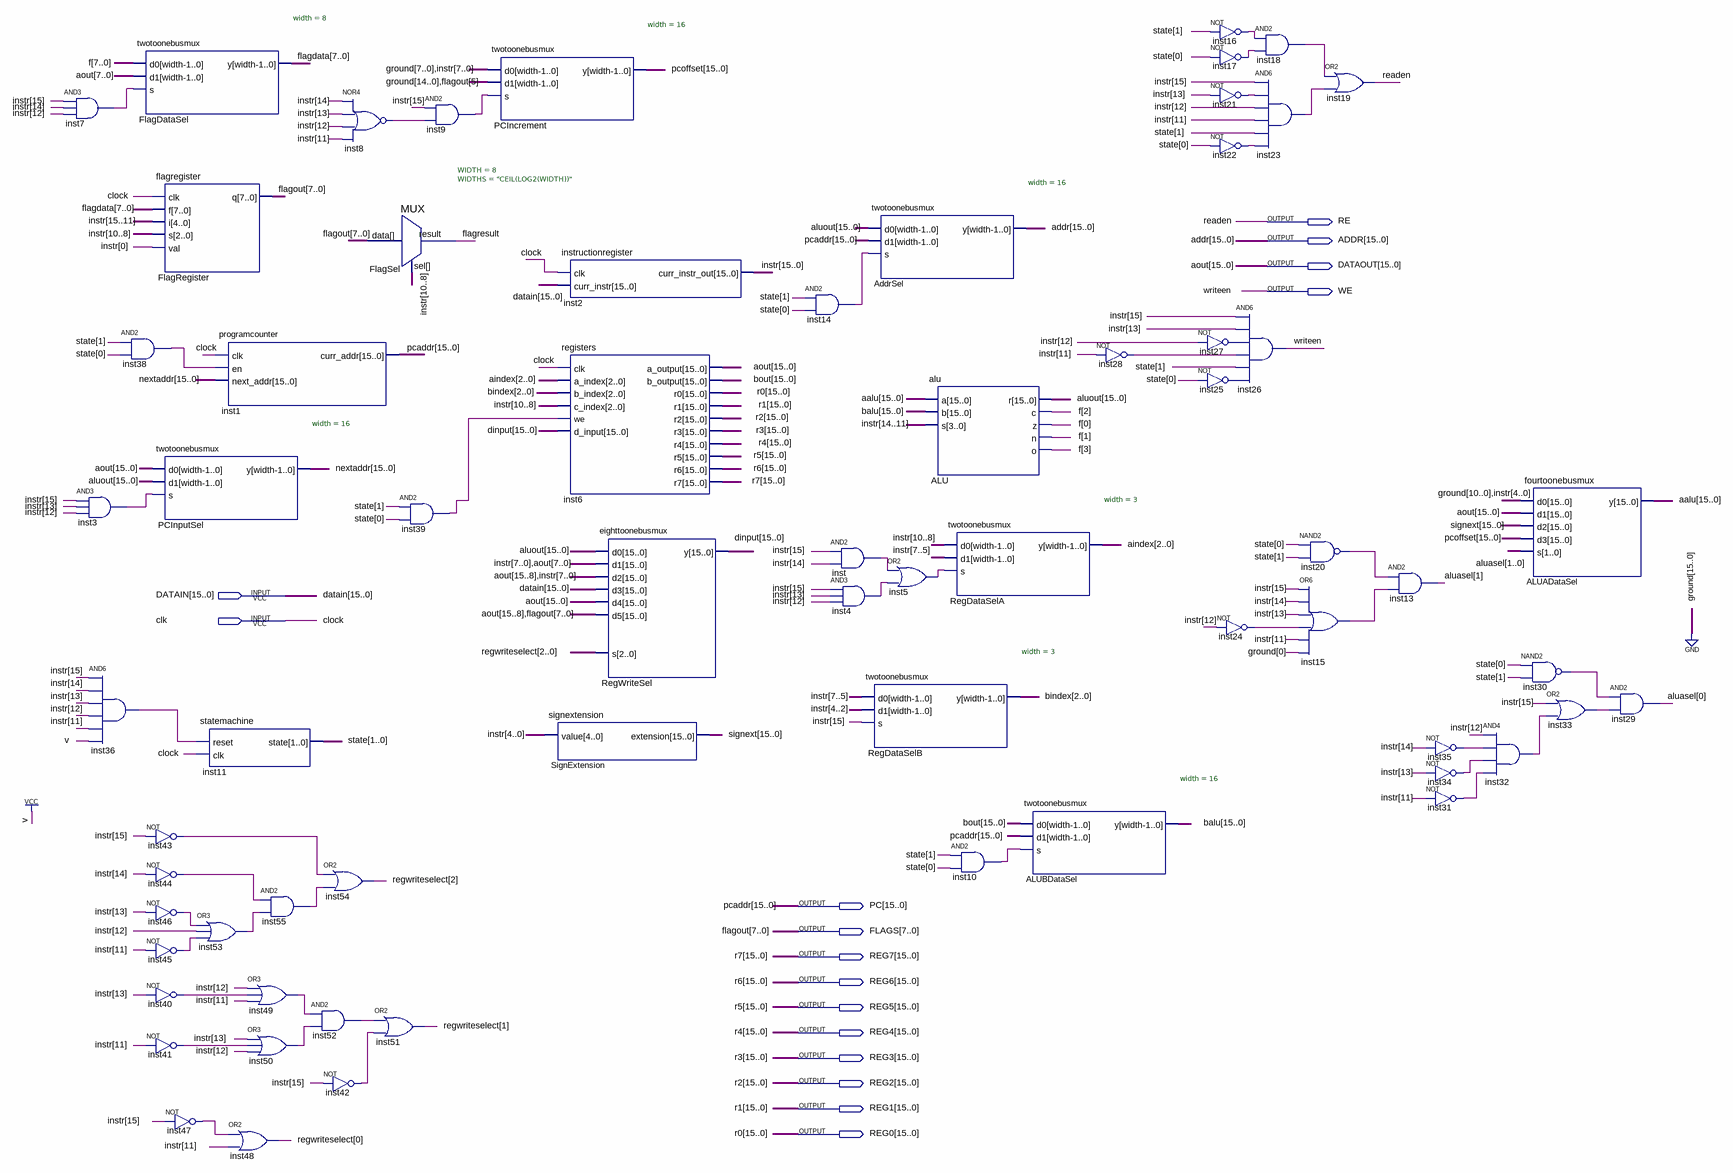
[diagram p0: schematic sheet]
// Quartus schematic cpu.bdf as structural Verilog: 67 symbols, 16 pins
module cpu (
  input  [15:0] DATAIN,
  input  clk,
  output RE,
  output [15:0] ADDR,
  output [15:0] DATAOUT,
  output WE,
  output [15:0] PC,
  output [7:0] FLAGS,
  output [15:0] REG7,
  output [15:0] REG6,
  output [15:0] REG5,
  output [15:0] REG4,
  output [15:0] REG3,
  output [15:0] REG2,
  output [15:0] REG1,
  output [15:0] REG0
);

  wire flagresult, inst3_out, inst4_out, inst5_out, inst7_out, inst8_out, inst9_out, inst10_out, inst14_out,
       inst15_out, inst16_out, inst17_out, inst18_out, inst20_out, inst21_out, inst22_out, inst23_out,
       inst24_out, inst25_out, inst27_out, inst28_out, inst30_out, inst31_out, inst32_out, inst33_out,
       inst34_out, inst35_out, inst36_out, inst38_out, inst39_out, inst40_out, inst41_out, inst42_out,
       inst43_out, inst44_out, inst45_out, inst46_out, inst47_out, inst49_out, inst50_out, inst52_out,
       inst53_out, inst55_out, inst_out;
  wire [1:0] aluasel, state;
  wire [2:0] aindex, bindex, regwriteselect;
  wire [7:0] f, flagdata;
  wire [15:0] aalu, aluout, balu, bout, dinput, instr, nextaddr, pcoffset, signext;

  and inst7 (inst7_out, instr[15], instr[14], instr[12]);
  and inst3 (inst3_out, instr[15], instr[13], instr[12]);
  twotoonebusmux #(.width(8)) FlagDataSel (.d0(f), .d1(DATAOUT[7:0]), .s(inst7_out), .y(flagdata));
  and inst38 (inst38_out, state[1], state[0]);
  and inst36 (inst36_out, instr[15], instr[14], instr[13], instr[12], instr[11], 1'b1);
  flagregister FlagRegister (.clk(clk), .f(flagdata), .i(instr[15:11]), .s(instr[10:8]), .val(instr[0]), .q(FLAGS));
  twotoonebusmux #(.width(16)) PCInputSel (.d0(DATAOUT), .d1(aluout), .s(inst3_out), .y(nextaddr));
  not inst43 (inst43_out, instr[15]);
  not inst44 (inst44_out, instr[14]);
  not inst46 (inst46_out, instr[13]);
  not inst45 (inst45_out, instr[11]);
  not inst40 (inst40_out, instr[13]);
  not inst41 (inst41_out, instr[11]);
  not inst47 (inst47_out, instr[15]);
  programcounter inst1 (.clk(clk), .en(inst38_out), .next_addr(nextaddr), .curr_addr(PC));
  statemachine inst11 (.reset(inst36_out), .clk(clk), .state(state));
  or inst53 (inst53_out, inst46_out, instr[12], inst45_out);
  or inst48 (regwriteselect[0], inst47_out, instr[11]);
  and inst55 (inst55_out, inst44_out, inst53_out);
  or inst49 (inst49_out, instr[12], inst40_out, instr[11]);
  or inst50 (inst50_out, instr[13], inst41_out, instr[12]);
  or inst54 (regwriteselect[2], inst43_out, inst55_out);
  and inst52 (inst52_out, inst49_out, inst50_out);
  not inst42 (inst42_out, instr[15]);
  nor inst8 (inst8_out, instr[14], instr[13], instr[12], instr[11]);
  MUX #(.WIDTH(8), .WIDTHS("CEIL(LOG2(WIDTH))")) FlagSel (.data(FLAGS), .sel(instr[10:8]), .result(flagresult));
  or inst51 (regwriteselect[1], inst52_out, inst42_out);
  and inst9 (inst9_out, instr[15], inst8_out);
  and inst39 (inst39_out, state[1], state[0]);
  twotoonebusmux #(.width(16)) PCIncrement (
    .d0({{8{1'b0}}, instr[7:0]}), .d1({{15{1'b0}}, FLAGS[5]}), .s(inst9_out), .y(pcoffset));
  instructionregister inst2 (.clk(clk), .curr_instr(DATAIN), .curr_instr_out(instr));
  registers inst6 (
    .clk(clk), .a_index(aindex), .b_index(bindex), .c_index(instr[10:8]), .we(inst39_out), .d_input(dinput),
    .a_output(DATAOUT), .b_output(bout), .r0(REG0), .r1(REG1), .r2(REG2), .r3(REG3), .r4(REG4), .r5(REG5),
    .r6(REG6), .r7(REG7));
  signextension SignExtension (.value(instr[4:0]), .extension(signext));
  eighttoonebusmux RegWriteSel (
    .d0(aluout), .d1({instr[7:0], DATAOUT[7:0]}), .d2({DATAOUT[15:8], instr[7:0]}), .d3(DATAIN),
    .d4(DATAOUT), .d5({DATAOUT[15:8], FLAGS}), .s(regwriteselect), .y(dinput));
  and inst14 (inst14_out, state[1], state[0]);
  and inst (inst_out, instr[15], instr[14]);
  and inst4 (inst4_out, instr[15], instr[13], instr[12]);
  twotoonebusmux #(.width(16)) AddrSel (.d0(aluout), .d1(PC), .s(inst14_out), .y(ADDR));
  or inst5 (inst5_out, inst_out, inst4_out);
  twotoonebusmux #(.width(3)) RegDataSelB (.d0(instr[7:5]), .d1(instr[4:2]), .s(instr[15]), .y(bindex));
  alu ALU (.a(aalu), .b(balu), .s(instr[14:11]), .r(aluout), .c(f[2]), .z(f[0]), .n(f[1]), .o(f[3]));
  twotoonebusmux #(.width(3)) RegDataSelA (.d0(instr[10:8]), .d1(instr[7:5]), .s(inst5_out), .y(aindex));
  and inst10 (inst10_out, state[1], state[0]);
  twotoonebusmux #(.width(16)) ALUBDataSel (.d0(bout), .d1(PC), .s(inst10_out), .y(balu));
  not inst28 (inst28_out, instr[11]);
  not inst27 (inst27_out, instr[12]);
  not inst25 (inst25_out, state[0]);
  not inst16 (inst16_out, state[1]);
  not inst17 (inst17_out, state[0]);
  not inst21 (inst21_out, instr[13]);
  not inst22 (inst22_out, state[0]);
  and inst26 (WE, instr[15], instr[13], inst27_out, inst28_out, state[1], inst25_out);
  not inst24 (inst24_out, instr[12]);
  and inst18 (inst18_out, inst16_out, inst17_out);
  and inst23 (inst23_out, instr[15], inst21_out, instr[12], instr[11], state[1], inst22_out);
  nand inst20 (inst20_out, state[0], state[1]);
  or inst15 (inst15_out, instr[15], instr[14], instr[13], inst24_out, instr[11], 1'b0);
  or inst19 (RE, inst18_out, inst23_out);
  and inst13 (aluasel[1], inst20_out, inst15_out);
  not inst35 (inst35_out, instr[14]);
  not inst34 (inst34_out, instr[13]);
  not inst31 (inst31_out, instr[11]);
  and inst32 (inst32_out, instr[12], inst35_out, inst34_out, inst31_out);
  fourtoonebusmux ALUADataSel (
    .d0({{11{1'b0}}, instr[4:0]}), .d1(DATAOUT), .d2(signext), .d3(pcoffset), .s(aluasel), .y(aalu));
  nand inst30 (inst30_out, state[0], state[1]);
  or inst33 (inst33_out, instr[15], inst32_out);
  and inst29 (aluasel[0], inst30_out, inst33_out);

  // Other names for the same wires on the sheet: aout[15:0] = DATAOUT; clock = clk; flagout[7:0] = FLAGS;
  //   pcaddr[15:0] = PC; r0[15:0] = REG0; r1[15:0] = REG1; r2[15:0] = REG2; r3[15:0] = REG3; r4[15:0] = REG4;
  //   r5[15:0] = REG5; r6[15:0] = REG6; r7[15:0] = REG7; readen = RE; writeen = WE
endmodule
